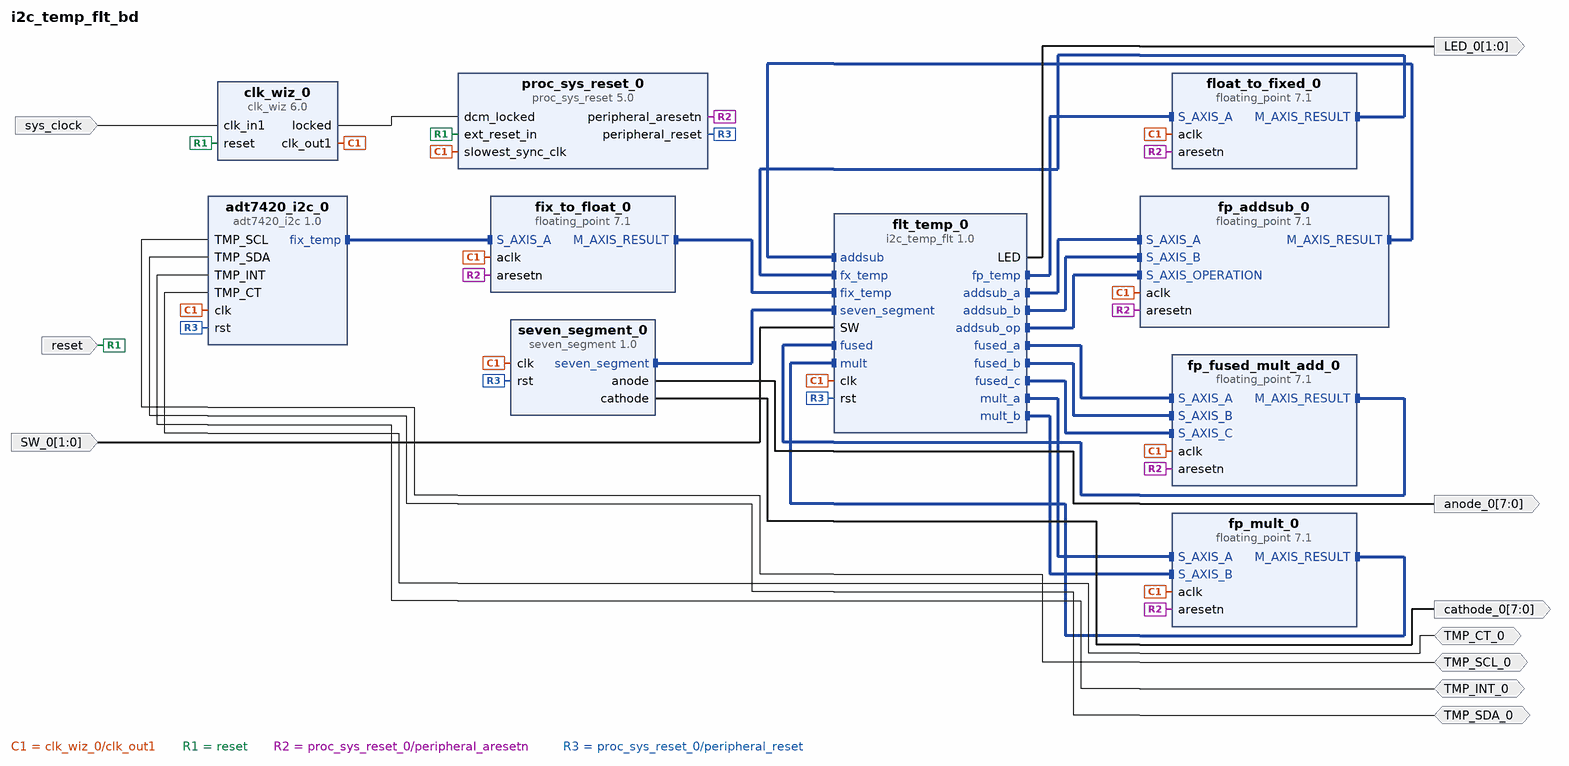
[diagram p0: block diagram of the top level]
# Vivado block design i2c_temp_flt_bd, xc7a100tcsg324-1, Vivado 2025.2
create_bd_design i2c_temp_flt_bd

create_bd_port -dir I -from 1 -to 0 SW_0
create_bd_port -dir O -from 1 -to 0 LED_0
create_bd_port -dir O -from 7 -to 0 anode_0
create_bd_port -dir O -from 7 -to 0 cathode_0
create_bd_port -dir IO TMP_SCL_0
create_bd_port -dir IO TMP_SDA_0
create_bd_port -dir IO TMP_INT_0
create_bd_port -dir IO TMP_CT_0
create_bd_port -dir I -type rst reset
set_property -dict {CONFIG.POLARITY ACTIVE_HIGH} [get_bd_ports reset]
create_bd_port -dir I -type clk sys_clock

create_bd_cell -type ip -vlnv packtpub.com:user:adt7420_i2c:1.0 adt7420_i2c_0
create_bd_cell -type ip -vlnv packtpub.com:user:i2c_temp_flt:1.0 flt_temp_0
create_bd_cell -type ip -vlnv packtpub.com:user:seven_segment:1.0 seven_segment_0
create_bd_cell -type ip -vlnv xilinx.com:ip:floating_point:7.1 fix_to_float_0
set_property -dict [list \
  CONFIG.A_Precision_Type Custom \
  CONFIG.C_A_Exponent_Width 12 \
  CONFIG.C_A_Fraction_Width 4 \
  CONFIG.C_Accum_Input_Msb 32 \
  CONFIG.C_Accum_Lsb -31 \
  CONFIG.C_Accum_Msb 32 \
  CONFIG.C_Latency 6 \
  CONFIG.C_Mult_Usage No_Usage \
  CONFIG.C_Rate 1 \
  CONFIG.C_Result_Exponent_Width 8 \
  CONFIG.C_Result_Fraction_Width 24 \
  CONFIG.Flow_Control NonBlocking \
  CONFIG.Has_ARESETn true \
  CONFIG.Has_RESULT_TREADY false \
  CONFIG.Operation_Type Fixed_to_float \
  CONFIG.Result_Precision_Type Single \
] [get_bd_cells fix_to_float_0]
create_bd_cell -type ip -vlnv xilinx.com:ip:floating_point:7.1 fp_mult_0
set_property -dict [list \
  CONFIG.C_Latency 8 \
  CONFIG.C_Mult_Usage Full_Usage \
  CONFIG.C_Rate 1 \
  CONFIG.C_Result_Exponent_Width 8 \
  CONFIG.C_Result_Fraction_Width 24 \
  CONFIG.Flow_Control NonBlocking \
  CONFIG.Has_ARESETn true \
  CONFIG.Has_RESULT_TREADY false \
  CONFIG.Operation_Type Multiply \
  CONFIG.Result_Precision_Type Single \
] [get_bd_cells fp_mult_0]
create_bd_cell -type ip -vlnv xilinx.com:ip:floating_point:7.1 float_to_fixed_0
set_property -dict [list \
  CONFIG.C_A_Exponent_Width 8 \
  CONFIG.C_A_Fraction_Width 24 \
  CONFIG.C_Accum_Input_Msb 32 \
  CONFIG.C_Accum_Lsb -31 \
  CONFIG.C_Accum_Msb 32 \
  CONFIG.C_Latency 6 \
  CONFIG.C_Mult_Usage No_Usage \
  CONFIG.C_Rate 1 \
  CONFIG.C_Result_Exponent_Width 11 \
  CONFIG.C_Result_Fraction_Width 4 \
  CONFIG.Flow_Control NonBlocking \
  CONFIG.Has_ARESETn true \
  CONFIG.Has_RESULT_TREADY false \
  CONFIG.Operation_Type Float_to_fixed \
  CONFIG.Result_Precision_Type Custom \
] [get_bd_cells float_to_fixed_0]
create_bd_cell -type ip -vlnv xilinx.com:ip:floating_point:7.1 fp_addsub_0
set_property -dict [list \
  CONFIG.Add_Sub_Value Both \
  CONFIG.C_Latency 11 \
  CONFIG.Flow_Control NonBlocking \
  CONFIG.Has_ARESETn true \
  CONFIG.Has_RESULT_TREADY false \
] [get_bd_cells fp_addsub_0]
create_bd_cell -type ip -vlnv xilinx.com:ip:floating_point:7.1 fp_fused_mult_add_0
set_property -dict [list \
  CONFIG.Add_Sub_Value Add \
  CONFIG.C_Latency 16 \
  CONFIG.C_Mult_Usage Medium_Usage \
  CONFIG.C_Rate 1 \
  CONFIG.C_Result_Exponent_Width 8 \
  CONFIG.C_Result_Fraction_Width 24 \
  CONFIG.Flow_Control NonBlocking \
  CONFIG.Has_ARESETn true \
  CONFIG.Has_RESULT_TREADY false \
  CONFIG.Operation_Type FMA \
  CONFIG.Result_Precision_Type Single \
] [get_bd_cells fp_fused_mult_add_0]
create_bd_cell -type ip -vlnv xilinx.com:ip:clk_wiz:6.0 clk_wiz_0
set_property -dict {CONFIG.RESET_PORT reset CONFIG.RESET_TYPE ACTIVE_HIGH} [get_bd_cells clk_wiz_0]
create_bd_cell -type ip -vlnv xilinx.com:ip:proc_sys_reset:5.0 proc_sys_reset_0

# ---- connections ----

connect_bd_intf_net [get_bd_intf_pins adt7420_i2c_0/fix_temp] [get_bd_intf_pins fix_to_float_0/S_AXIS_A]
connect_bd_intf_net [get_bd_intf_pins fix_to_float_0/M_AXIS_RESULT] [get_bd_intf_pins flt_temp_0/fix_temp]
connect_bd_intf_net [get_bd_intf_pins float_to_fixed_0/M_AXIS_RESULT] [get_bd_intf_pins flt_temp_0/fx_temp]
connect_bd_intf_net [get_bd_intf_pins fp_addsub_0/M_AXIS_RESULT] [get_bd_intf_pins flt_temp_0/addsub]
connect_bd_intf_net [get_bd_intf_pins fp_fused_mult_add_0/M_AXIS_RESULT] [get_bd_intf_pins flt_temp_0/fused]
connect_bd_intf_net [get_bd_intf_pins fp_mult_0/M_AXIS_RESULT] [get_bd_intf_pins flt_temp_0/mult]
connect_bd_intf_net -intf_net i2c_temp_flt_0_addsub_a [get_bd_intf_pins fp_addsub_0/S_AXIS_A] [get_bd_intf_pins flt_temp_0/addsub_a]
connect_bd_intf_net -intf_net i2c_temp_flt_0_addsub_b [get_bd_intf_pins fp_addsub_0/S_AXIS_B] [get_bd_intf_pins flt_temp_0/addsub_b]
connect_bd_intf_net -intf_net i2c_temp_flt_0_addsub_op [get_bd_intf_pins fp_addsub_0/S_AXIS_OPERATION] [get_bd_intf_pins flt_temp_0/addsub_op]
connect_bd_intf_net -intf_net i2c_temp_flt_0_fp_temp [get_bd_intf_pins float_to_fixed_0/S_AXIS_A] [get_bd_intf_pins flt_temp_0/fp_temp]
connect_bd_intf_net -intf_net i2c_temp_flt_0_fused_a [get_bd_intf_pins fp_fused_mult_add_0/S_AXIS_A] [get_bd_intf_pins flt_temp_0/fused_a]
connect_bd_intf_net -intf_net i2c_temp_flt_0_fused_b [get_bd_intf_pins fp_fused_mult_add_0/S_AXIS_B] [get_bd_intf_pins flt_temp_0/fused_b]
connect_bd_intf_net -intf_net i2c_temp_flt_0_fused_c [get_bd_intf_pins fp_fused_mult_add_0/S_AXIS_C] [get_bd_intf_pins flt_temp_0/fused_c]
connect_bd_intf_net -intf_net i2c_temp_flt_0_mult_a [get_bd_intf_pins fp_mult_0/S_AXIS_A] [get_bd_intf_pins flt_temp_0/mult_a]
connect_bd_intf_net -intf_net i2c_temp_flt_0_mult_b [get_bd_intf_pins fp_mult_0/S_AXIS_B] [get_bd_intf_pins flt_temp_0/mult_b]
connect_bd_intf_net -intf_net i2c_temp_flt_0_seven_segment [get_bd_intf_pins seven_segment_0/seven_segment] [get_bd_intf_pins flt_temp_0/seven_segment]
connect_bd_net [get_bd_ports TMP_SCL_0] [get_bd_pins adt7420_i2c_0/TMP_SCL]
connect_bd_net [get_bd_ports TMP_SDA_0] [get_bd_pins adt7420_i2c_0/TMP_SDA]
connect_bd_net [get_bd_ports TMP_INT_0] [get_bd_pins adt7420_i2c_0/TMP_INT]
connect_bd_net [get_bd_ports TMP_CT_0] [get_bd_pins adt7420_i2c_0/TMP_CT]
connect_bd_net -net SW_0_1 [get_bd_ports SW_0] [get_bd_pins flt_temp_0/SW]
connect_bd_net -net clk_in1_0_1 [get_bd_ports sys_clock] [get_bd_pins clk_wiz_0/clk_in1]
connect_bd_net [get_bd_pins clk_wiz_0/clk_out1] \
  [get_bd_pins proc_sys_reset_0/slowest_sync_clk] [get_bd_pins fix_to_float_0/aclk] [get_bd_pins fp_addsub_0/aclk] \
  [get_bd_pins float_to_fixed_0/aclk] [get_bd_pins fp_fused_mult_add_0/aclk] [get_bd_pins fp_mult_0/aclk] \
  [get_bd_pins adt7420_i2c_0/clk] [get_bd_pins flt_temp_0/clk] [get_bd_pins seven_segment_0/clk]
connect_bd_net [get_bd_pins clk_wiz_0/locked] [get_bd_pins proc_sys_reset_0/dcm_locked]
connect_bd_net -net ext_reset_in_0_1 [get_bd_ports reset] [get_bd_pins proc_sys_reset_0/ext_reset_in] [get_bd_pins clk_wiz_0/reset]
connect_bd_net -net i2c_temp_flt_0_LED [get_bd_pins flt_temp_0/LED] [get_bd_ports LED_0]
connect_bd_net [get_bd_pins proc_sys_reset_0/peripheral_aresetn] \
  [get_bd_pins fp_addsub_0/aresetn] [get_bd_pins fp_mult_0/aresetn] [get_bd_pins fix_to_float_0/aresetn] \
  [get_bd_pins fp_fused_mult_add_0/aresetn] [get_bd_pins float_to_fixed_0/aresetn]
connect_bd_net [get_bd_pins proc_sys_reset_0/peripheral_reset] \
  [get_bd_pins adt7420_i2c_0/rst] [get_bd_pins flt_temp_0/rst] [get_bd_pins seven_segment_0/rst]
connect_bd_net [get_bd_pins seven_segment_0/anode] [get_bd_ports anode_0]
connect_bd_net [get_bd_pins seven_segment_0/cathode] [get_bd_ports cathode_0]

validate_bd_design
save_bd_design
